# EAGLE design meter (EAGLE 6.5.0)
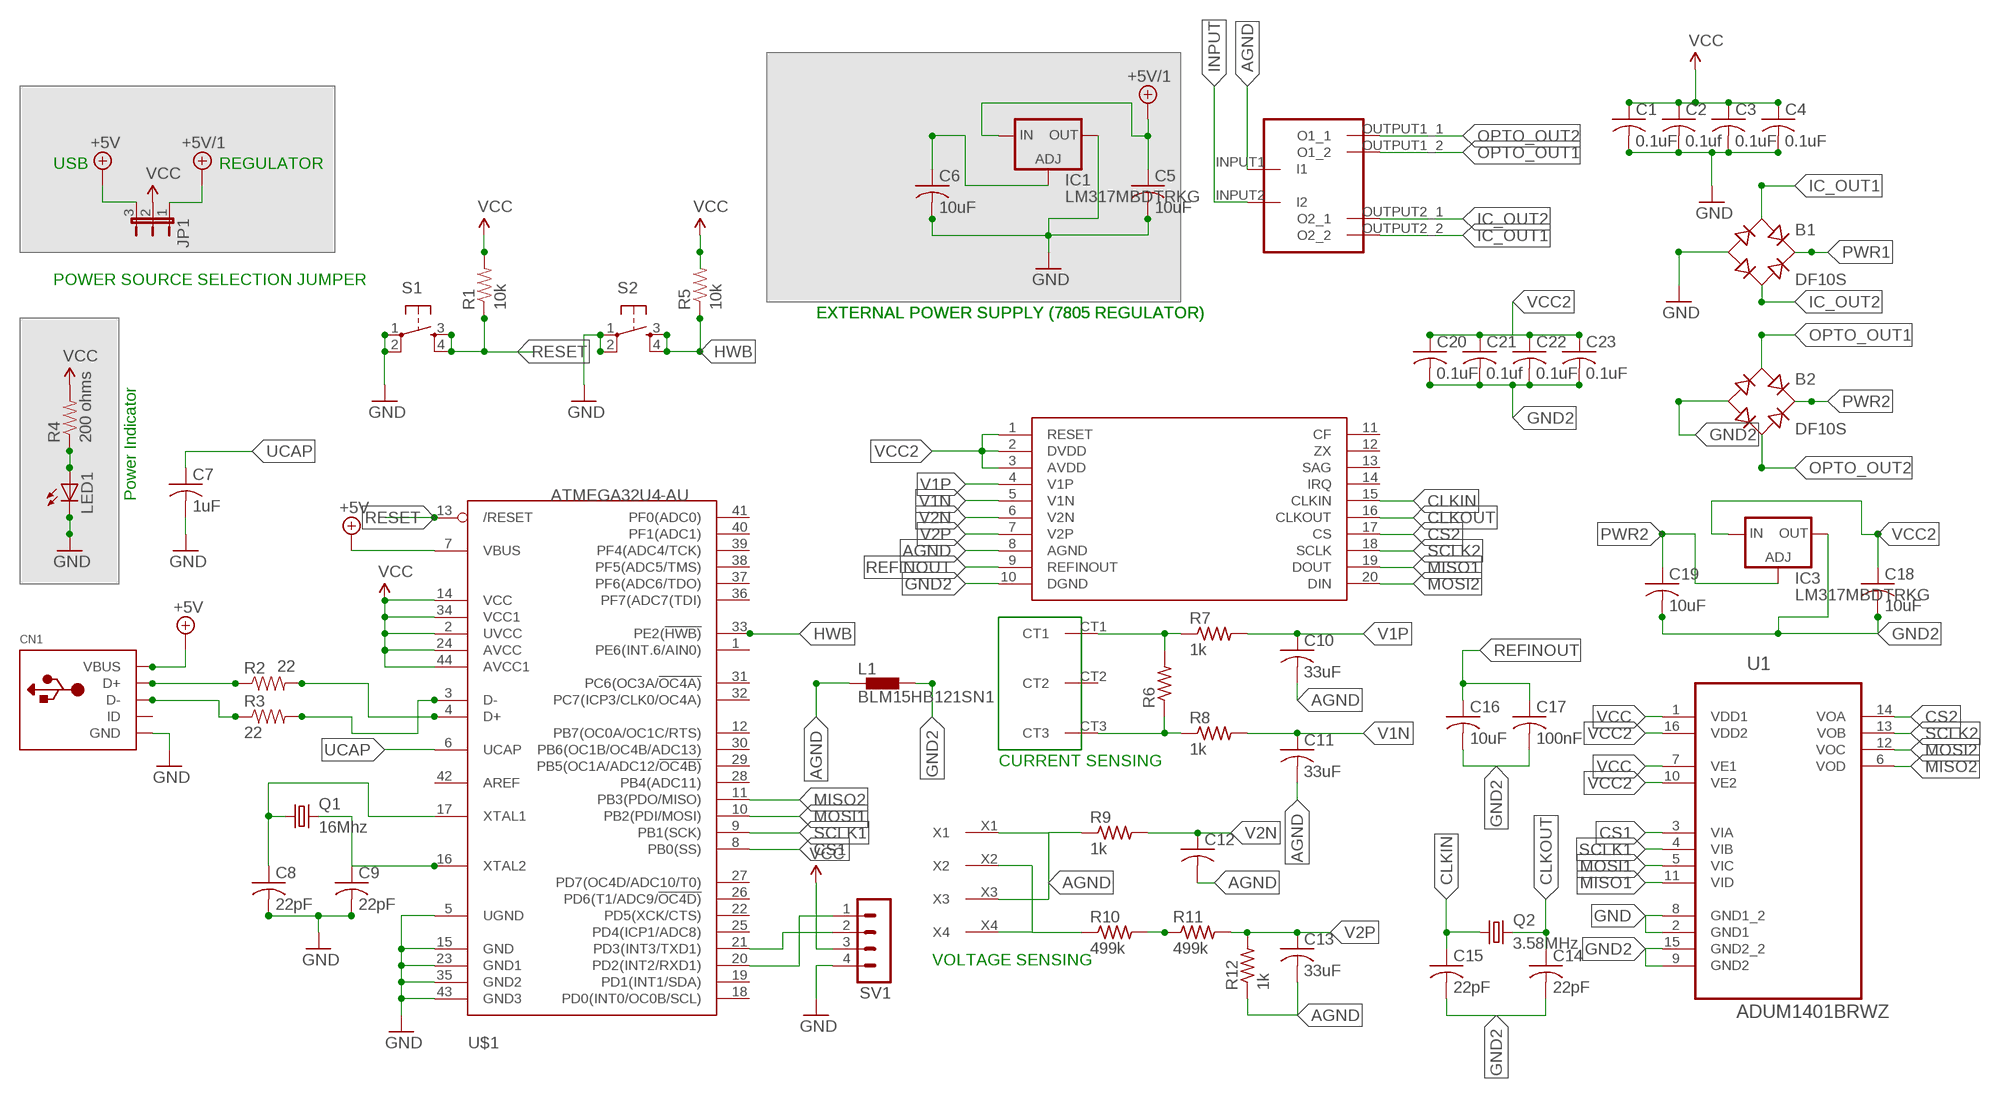
[diagram p0: schematic, sheet 1]

## Parts
B1  DF10S  [DFS]
B2  DF10S  [DFS]
C1  0.1uF  C-USC0603  [C0603]
C2  0.1uf  C-USC0603  [C0603]
C3  0.1uF  C-USC0603  [C0603]
C4  0.1uF  C-USC0603  [C0603]
C5  10uF  C-USC0603  [C0603]
C6  10uF  C-USC0603  [C0603]
C7  1uF  C-USC0603  [C0603]
C8  22pF  C-USC0603  [C0603]
C9  22pF  C-USC0603  [C0603]
C10  33uF  C-USC0603  [C0603]
C11  33uF  C-USC0603  [C0603]
C12  C-USC0603  [C0603]
C13  33uF  C-USC0603  [C0603]
C14  22pF  C-USC0603  [C0603]
C15  22pF  C-USC0603  [C0603]
C16  10uF  C-USC0603  [C0603]
C17  100nF  C-USC0603  [C0603]
C18  10uF  C-USC0603  [C0603]
C19  10uF  C-USC0603  [C0603]
C20  0.1uF  C-USC0603  [C0603]
C21  0.1uf  C-USC0603  [C0603]
C22  0.1uF  C-USC0603  [C0603]
C23  0.1uF  C-USC0603  [C0603]
CN1  USBMINIB  [USB-MINIB]
IC1  LM317MBDTRKG  [DPACK]
IC3  LM317MBDTRKG  [DPACK]
JP1  JP2E  [JP2]
L1  BLM15HB121SN1  [0402]
LED1  LEDCHIP-LED0805  [CHIP-LED0805]
Q1  16Mhz  CSM-7X-DU  [CSM-7X-DU]
Q2  3.58MHz  CSM-7X-DU  [CSM-7X-DU]
R1  10k  RESISTOR0603-RES  [0603-RES]
R2  22  RESISTOR0603-RES  [0603-RES]
R3  22  RESISTOR0603-RES  [0603-RES]
R4  200 ohms  RESISTOR0603-RES  [0603-RES]
R5  10k  RESISTOR0603-RES  [0603-RES]
R6  R-US_R0603  [R0603]
R7  1k  R-US_R0603  [R0603]
R8  1k  R-US_R0603  [R0603]
R9  1k  R-US_R0603  [R0603]
R10  499k  R-US_R0603  [R0603]
R11  499k  R-US_R0603  [R0603]
R12  1k  R-US_R0603  [R0603]
S1  TAC_SWITCHSMD  [TACTILE_SWITCH_SMD]
S2  TAC_SWITCHSMD  [TACTILE_SWITCH_SMD]
SV1  MA04-1  [MA04-1]
U1  ADUM1401BRWZ  [SOIC127P1032X265-16N]
U$1  ATMEGA32U4-AU  [TQFP44]
U$2  ADE7753  [SSOP20]
U$3  CT  [CT1075]
U$4  PCB-TRANS  [PCB-TRANS]
U$6  SCREWTERMINAL4_9.53  [SCREWTERMINAL4_9.53]

## Nets
+5V: CN1.VBUS JP1.3 U$1.7(VBUS)
+5V/1: C5.1 IC1.3(IN) JP1.1
AGND: C10.2 C11.2 C12.2 C13.2 L1.1 R9.1 R12.1 U$2.8(AGND) U$4.INPUT1(I1) U$6.X1 U$6.X3
CLKIN: C15.1 Q2.1 U$2.15(CLKIN)
CLKOUT: C14.1 Q2.2 U$2.16(CLKOUT)
CS1: U1.3(VIA) U$1.8(PB0(SS))
CS2: U1.14(VOA) U$2.17(CS)
GND: B1.- C1.2 C2.2 C3.2 C4.2 C5.2 C6.2 C7.2 C8.2 C9.2 CN1.GND IC1.4(OUT) LED1.C S1.1 S1.2 S2.1 S2.2 SV1.4 U1.2(GND1) U1.8(GND1_2) U$1.5(UGND) U$1.15(GND) U$1.23(GND1) U$1.35(GND2) U$1.43(GND3)
GND2: B2.- C14.2 C15.2 C16.2 C17.2 C18.2 C19.2 C20.2 C21.2 C22.2 C23.2 IC3.4(OUT) L1.2 U1.9(GND2) U1.15(GND2_2) U$2.10(DGND)
HWB: R5.1 S2.3 S2.4 U$1.33(PE2(!HWB))
IC_OUT1: B1.AC1 U$4.OUTPUT2_2(O2_2)
IC_OUT2: B1.AC2 U$4.OUTPUT2_1(O2_1)
INPUT: R10.1 U$4.INPUT2(I2) U$6.X2 U$6.X4
MISO1: U1.11(VID) U$2.19(DOUT)
MISO2: U1.6(VOD) U$1.11(PB3(PDO/MISO))
MOSI1: U1.5(VIC) U$1.10(PB2(PDI/MOSI))
MOSI2: U1.12(VOC) U$2.20(DIN)
N$1: C8.1 Q1.1 U$1.17(XTAL1)
N$2: R10.2 R11.1
N$3: CN1.D+ R2.1
N$4: R2.2 U$1.4(D+)
N$5: CN1.D- R3.1
N$6: R3.2 U$1.3(D-)
N$7: LED1.A R4.1
N$10: SV1.1 U$1.20(PD2(INT2/RXD1))
N$11: SV1.2 U$1.21(PD3(INT3/TXD1))
N$13: R6.2 R7.1 U$3.CT1
N$14: R6.1 R8.1 U$3.CT3
N$17: C9.1 Q1.2 U$1.16(XTAL2)
OPTO_OUT1: B2.AC1 U$4.OUTPUT1_2(O1_2)
OPTO_OUT2: B2.AC2 U$4.OUTPUT1_1(O1_1)
PWR1: B1.+ C6.1 IC1.1(ADJ)
PWR2: B2.+ C19.1 IC3.1(ADJ)
REFINOUT: C16.1 C17.1 U$2.9(REFINOUT)
RESET: R1.1 S1.3 S1.4 U$1.13(/RESET)
SCLK1: U1.4(VIB) U$1.9(PB1(SCK))
SCLK2: U1.13(VOB) U$2.18(SCLK)
UCAP: C7.1 U$1.6(UCAP)
V1N: C11.1 R8.2 U$2.5(V1N)
V1P: C10.1 R7.2 U$2.4(V1P)
V2N: C12.1 R9.2 U$2.6(V2N)
V2P: C13.1 R11.2 R12.2 U$2.7(V2P)
VCC: C1.1 C2.1 C3.1 C4.1 JP1.2 R1.2 R4.2 R5.2 SV1.3 U1.1(VDD1) U1.7(VE1) U$1.2(UVCC) U$1.14(VCC) U$1.24(AVCC) U$1.34(VCC1) U$1.44(AVCC1)
VCC2: C18.1 C20.1 C21.1 C22.1 C23.1 IC3.3(IN) U1.10(VE2) U1.16(VDD2) U$2.1(RESET) U$2.2(DVDD) U$2.3(AVDD)
Unconnected: CN1.ID U$1.1(PE6(INT.6/AIN0)) U$1.12(PB7(OC0A/OC1C/RTS)) U$1.18(PD0(INT0/OC0B/SCL)) U$1.19(PD1(INT1/SDA)) U$1.22(PD5(XCK/CTS)) U$1.25(PD4(ICP1/ADC8)) U$1.26(PD6(T1/ADC9/!OC4D)) U$1.27(PD7(OC4D/ADC10/T0)) U$1.28(PB4(ADC11)) U$1.29(PB5(OC1A/ADC12/!OC4B)) U$1.30(PB6(OC1B/OC4B/ADC13)) U$1.31(PC6(OC3A/!OC4A)) U$1.32(PC7(ICP3/CLK0/OC4A)) U$1.36(PF7(ADC7(TDI)) U$1.37(PF6(ADC6/TDO)) U$1.38(PF5(ADC5/TMS)) U$1.39(PF4(ADC4/TCK)) U$1.40(PF1(ADC1)) U$1.41(PF0(ADC0)) U$1.42(AREF) U$2.11(CF) U$2.12(ZX) U$2.13(SAG) U$2.14(IRQ) U$3.CT2

## Notes on the sheet
- USB | REGULATOR
- POWER SOURCE SELECTION JUMPER
- EXTERNAL POWER SUPPLY (7805 REGULATOR) | EXTERNAL POWER SUPPLY (7805 REGULATOR)
- Power Indicator
- CURRENT SENSING
- VOLTAGE SENSING

## Library data of the parts
B1 B2 = rectifier:DF*S: Surface Mount Glass Passivated Bridge Rectifiers Source: Source: Comchip Bridge Rectifiers DF005S-G thru DF10S-G.pdf
C1-C23 = adafruit:C-US: CAPACITOR, American symbol
CN1 = adafruit:USB: USB Connectors USBMINIB - Surface Mount Female Mini-B USB Connector 4UConnector: 06564 By microbuilder.eu Thru-hole RA Female Mini-B USB Connector 4UConnector: 18732 By ladyada.net
IC1 IC3 = v-reg:LM317?*: 500 mA Adjustable Output Positive Voltage Regulator Source: http://www.onsemi.co.jp .. LM317M-D.PDF
JP1 = jumper:JP2E: JUMPER
L1 = inductors:BLM15H: EMIFIL (R) Chip Ferrite Bead for GHz Noise Source: http://www.murata.com/ Ferrite Bead BLM15H.pdf
LED1 = adafruit:LED: LED OSRAM: - CHIPLED LG R971, LG N971, LY N971, LG Q971, LY Q971, LO R971, LY R971 LH N974, LH R974 LS Q976, LO Q976, LY Q976 LO Q996 - Hyper CHIPLED LW Q18S LB Q993, LB Q99A, LB R99A - SideLED LS A670, LO A670, LY A670, LG A670, LP A670 LB A673, LV A673, LT A673, LW A673 LH A674 LY A675 LS A676, LA A676, LO A676, LY A676, LW A676 LS A679, LY A679, LG A679 - Hyper Micro SIDELED® LS Y876, LA Y876, LO Y876, LY Y876 LT Y87S - SmartLED LW L88C, LW L88S LB L89C, LB L89S, LG L890 LS L89K, LO L89K, LY L89K LS L896, LA L896, LO L896, LY L896 - TOPLED LS T670, LO T670, LY T670, LG T670, LP T670 LSG T670, LSP T670, LSY T670, LOP T670, LYG T670 LG T671, LOG T671, LSG T671 LB T673, LV T673, LT T673, LW T673 LH T674 LS T676, LA T676, LO T676, LY T676, LB T676, LH T676, LSB T676, LW T676 LB T67C, LV T67C, LT T67C, LS T67K, LO T67K, LY T67K, LW E67C LS E67B, LA E67B, LO E67B, LY E67B, LB E67C, LV E67C, LT E67C LW T67C LS T679, LY T679, LG T679 LS T770, LO T770, LY T770, LG T770, LP T770 LB T773, LV T773, LT T773, LW T773 LH T774 LS E675, LA E675, LY E675, LS T675 LS T776, LA T776, LO T776, LY T776, LB T776 LHGB T686 LT T68C, LB T68C - Hyper Mini TOPLED® LB M676 - Mini TOPLED Santana® LG M470 LS M47K, LO M47K, LY M47K Source: http://www.osram.convergy.de/
Q1 Q2 = crystal:CSM-7X-DU: SMD CRYSTAL Source: www.ecsxtal.com .. Crystal 3.6864MHz CSM_7X_DU.PDF; OC_FARNELL: unknown; OC_NEWARK: unknown
R1-R5 = SparkFun-Passives:RESISTOR: Resistor Basic schematic elements and footprints for 0603, 1206, and PTH resistors.
R6-R12 = adafruit:R-US_: RESISTOR, American symbol
S1 S2 = SparkFun-Electromechanical:TAC_SWITCH: Momentary Switch Button commonly used for reset or general input. Spark Fun Electronics SKU : COM-00097 SMT- SWCH-08247; PROD_ID: SWCH-08247
SV1 = con-lstb:MA04-1: PIN HEADER; OC_FARNELL: unknown; OC_NEWARK: unknown
U1 = adum:ADUM1401BRWZ: Quad-Channel Digital Isolators; MPN: ADUM1401BRWZ; OC_FARNELL: 1226221; OC_NEWARK: 59K3278; PACKAGE: SOIC-16; SUPPLIER: Analog Devices
U$1 = adafruit:ATMEGA32U4: http://www.ladyada.net/library/eagle
U$2 = ade7735:ADE7753
U$3 = ct1075:CT
U$4 = pcbtrans:PCB-TRANS
U$6 = screwtermi4:SCREWTERMINAL4_9.53

## Net classes
0 default: clearance 0.381 mm

## Board
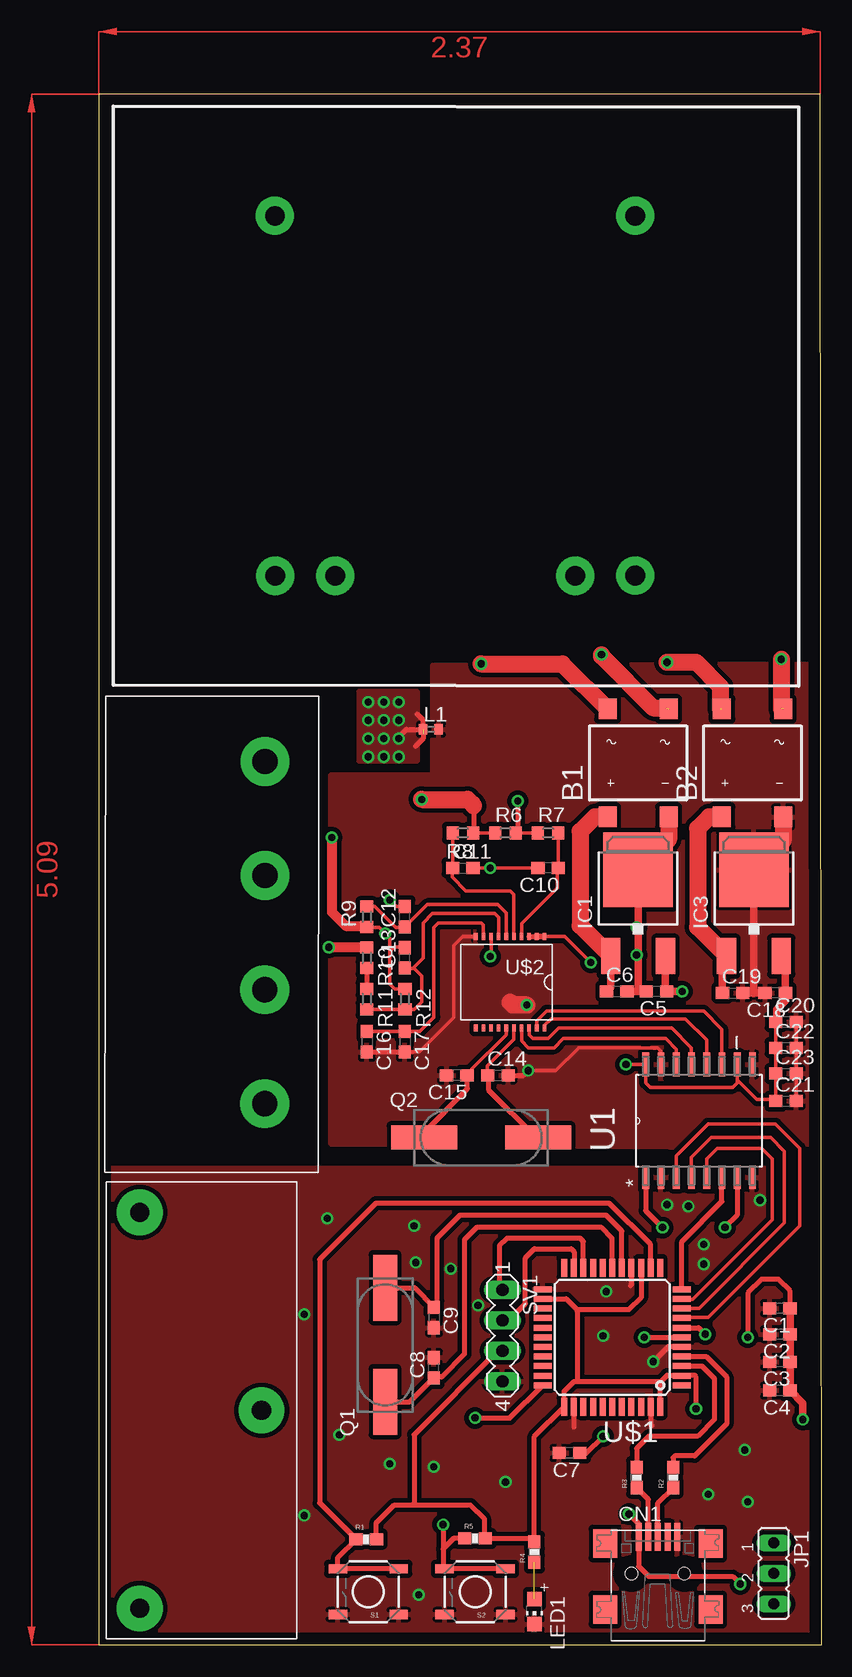
[diagram p1: board, top side]
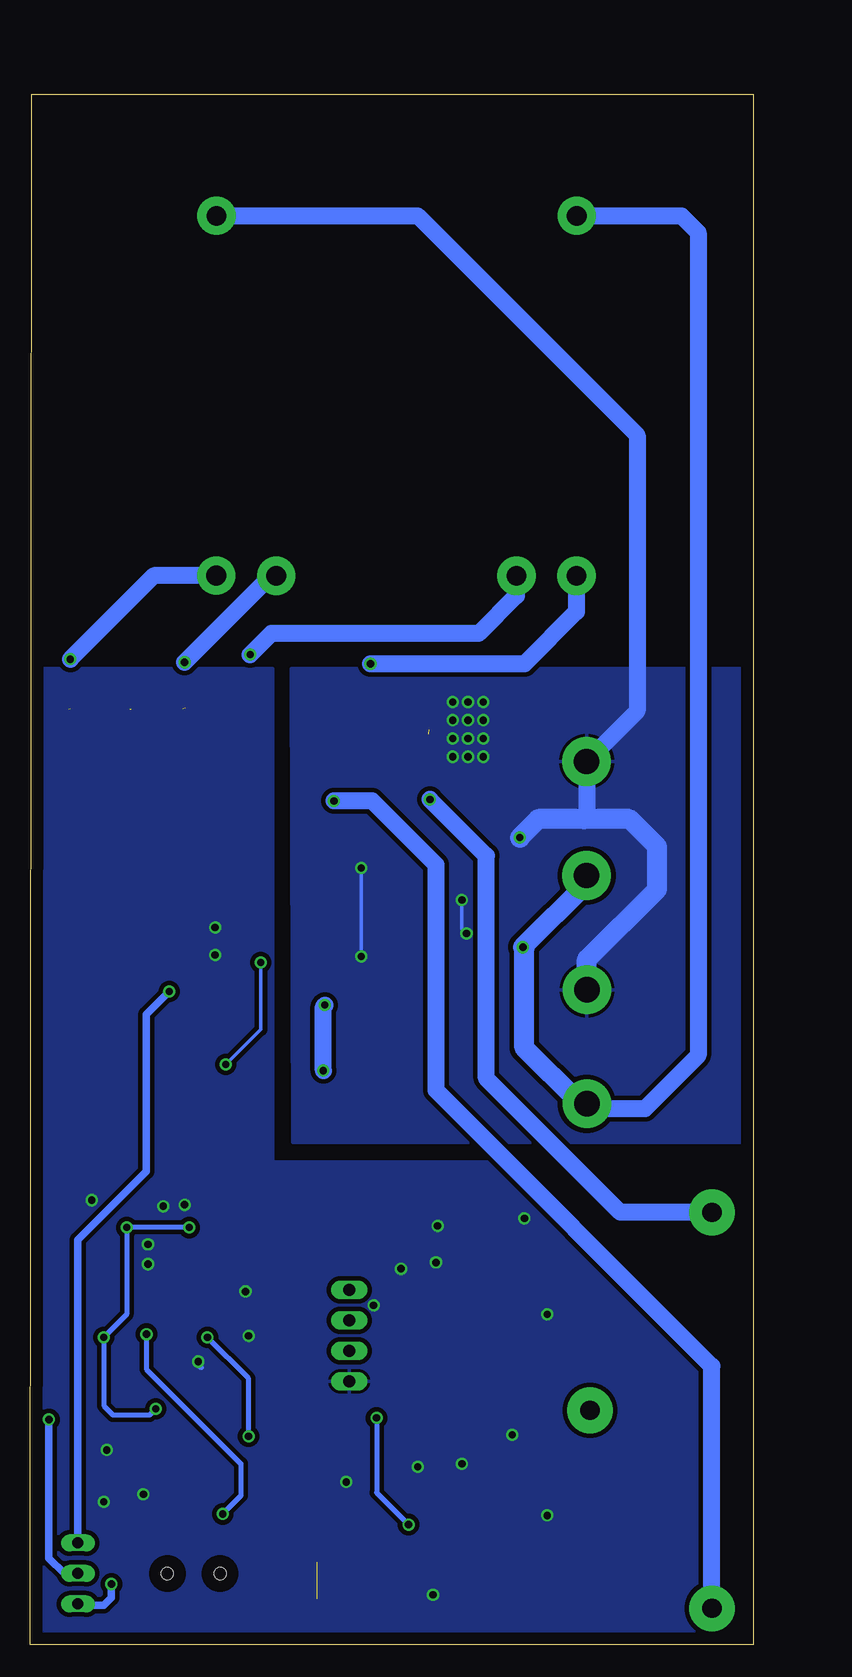
[diagram p2: board, bottom side, seen from below]

Size 60.25 x 129.28 mm. Coordinates in mm from the lower left corner, seen from the top.
Outline: 0,0 60.25,0 60.12,129.28 0,129.28 0,0
Copper layers (1*16): Top 0.035mm / dielectric 1.5mm / Bottom 0.035mm
Design rules "default": minimum track width 10mil, minimum drill 24mil, track to track 8mil, track to pad 8mil, pad to pad 8mil, via to via 8mil, smd to smd 8mil, copper to edge 40mil, drill to drill 8mil, minimum pad ring 10mil, minimum via ring 8mil, stop-mask expansion 4mil, vias tented up to drill 0mil, thermal gap 10mil

### Footprints (pad centres in the part's own frame; a part is rotated, then mirrored left to right if it is on the bottom)
DFS = smd 1.5 x 1.7: + -2.55,-4.5; - 2.55,-4.5; AC1 -2.55,4.5; AC2 2.55,4.5
C0603 = smd 1.1 x 1: 1 -0.85,0; 2 0.85,0
USB-MINIB = smd 0.5 x 2.308: D+ 0,4.064; D- -0.8,4.064; GND 1.6,4.064; ID 0.8,4.064; VBUS -1.6,4.064 | smd 2 x 2.4: GND1 -4.4,-2; GND2 -4.4,3.5; GND3 4.4,3.5; GND4 4.4,-2 | hole 1: -2.2,1; 2.2,1
DPACK = smd 1.6 x 3: 1 -2.28,-4.8; 3 2.28,-4.8 | smd 5.8 x 6.2: 4 0,2.38
JP2 = drill 0.914 long: 1 -2.54,0; 2 0,0; 3 2.54,0
0402 = smd 0.7 x 0.9: 1 -0.65,0; 2 0.65,0
CHIP-LED0805 = smd 1.2 x 1.2: A 0,-1.05; C 0,1.05
CSM-7X-DU = smd 5.5 x 2: 1 -4.75,0; 2 4.75,0
0603-RES = smd 1.1 x 1: 1 -0.85,0; 2 0.85,0
R0603 = smd 1 x 1.1: 1 -0.85,0; 2 0.85,0
TACTILE_SWITCH_SMD = smd 1.524 x 0.762: 1 -2.54,1.905; 2 2.54,1.905; 3 -2.54,-1.905; 4 2.54,-1.905
MA04-1 = drill 1.016 long: 1 -3.81,0; 2 -1.27,0; 3 1.27,0; 4 3.81,0
SOIC127P1032X265-16N = smd 1.981 x 0.559: 1 -4.699,4.445; 2 -4.699,3.175; 3 -4.699,1.905; 4 -4.699,0.635; 5 -4.699,-0.635; 6 -4.699,-1.905; 7 -4.699,-3.175; 8 -4.699,-4.445; 9 4.699,-4.445; 10 4.699,-3.175; 11 4.699,-1.905; 12 4.699,-0.635; 13 4.699,0.635; 14 4.699,1.905; 15 4.699,3.175; 16 4.699,4.445
TQFP44 = smd 1.5 x 0.5: 1 -5.8,4; 2 -5.8,3.2; 3 -5.8,2.4; 4 -5.8,1.6; 5 -5.8,0.8; 6 -5.8,0; 7 -5.8,-0.8; 8 -5.8,-1.6; 9 -5.8,-2.4; 10 -5.8,-3.2; 11 -5.8,-4; 23 5.8,-4; 24 5.8,-3.2; 25 5.8,-2.4; 26 5.8,-1.6; 27 5.8,-0.8; 28 5.8,0; 29 5.8,0.8; 30 5.8,1.6; 31 5.8,2.4; 32 5.8,3.2; 33 5.8,4 | smd 0.5 x 1.5: 12 -4,-5.8; 13 -3.2,-5.8; 14 -2.4,-5.8; 15 -1.6,-5.8; 16 -0.8,-5.8; 17 0,-5.8; 18 0.8,-5.8; 19 1.6,-5.8; 20 2.4,-5.8; 21 3.2,-5.8; 22 4,-5.8; 34 4,5.8; 35 3.2,5.8; 36 2.4,5.8; 37 1.6,5.8; 38 0.8,5.8; 39 0,5.8; 40 -0.8,5.8; 41 -1.6,5.8; 42 -2.4,5.8; 43 -3.2,5.8; 44 -4,5.8
SSOP20 = smd 0.305 x 0.61: 1 -3.493,-3.81; 2 -2.857,-3.81; 3 -2.223,-3.81; 4 -1.587,-3.81; 5 -0.953,-3.81; 6 -0.318,-3.81; 7 0.318,-3.81; 8 0.953,-3.81; 9 1.587,-3.81; 10 2.223,-3.81; 11 2.223,3.81; 12 1.587,3.81; 13 0.953,3.81; 14 0.318,3.81; 15 -0.318,3.81; 16 -0.953,3.81; 17 -1.587,3.81; 18 -2.223,3.81; 19 -2.857,3.81; 20 -3.493,3.81
CT1075 = drill 1.6 pad 3.81: CT1 -16.51,9.915; CT2 0,-0.245; CT3 16.51,9.915
PCB-TRANS = drill 1.651 pad 3.175: INPUT1 14.991,14.988; INPUT2 -15.027,14.988; OUTPUT1_1 15.006,-15.003; OUTPUT1_2 10.001,-15.017; OUTPUT2_1 -10.005,-15.016; OUTPUT2_2 -15.005,-15.017
SCREWTERMINAL4_9.53 = drill 2.108 pad 4.064: X1 -14.342,4.472; X2 -4.831,4.472; X3 4.695,4.442; X4 14.191,4.442

### Placement (x,y rotation side)
B1  44.96,73.53 0 top
B2  54.48,73.53 0 top
C1  56.77,28.07 180 top
C2  56.77,25.91 180 top
C3  56.77,23.62 180 top
C4  56.77,21.21 180 top
C5  46.48,54.48 180 top
C6  43.18,54.48 0 top
C7  39.24,16 180 top
C8  27.94,23.11 90 top
C9  27.94,27.3 270 top
C10  37.47,64.77 180 top
C11  30.35,64.77 0 top
C12  25.53,60.71 90 top
C13  25.53,57.28 90 top
C14  33.27,47.5 0 top
C15  29.84,47.5 180 top
C16  22.35,50.29 270 top
C17  25.53,50.29 270 top
C18  56.39,54.36 180 top
C19  52.83,54.36 0 top
C20  57.28,51.94 0 top
C21  57.28,45.34 0 top
C22  57.28,49.78 0 top
C23  57.28,47.62 0 top
CN1  46.61,4.95 0 top
IC1  44.96,62.23 0 top
IC3  54.61,62.23 0 top
JP1  56.26,5.97 270 top
L1  27.69,76.33 0 top
LED1  36.32,2.79 180 top
Q1  23.88,25.02 90 top
Q2  31.88,42.29 0 top
R1  22.3,8.81 0 top
R2  47.88,13.97 90 top
R3  44.83,13.97 90 top
R4  36.32,7.75 90 top
R5  31.37,8.89 0 top
R6  33.91,67.69 0 top
R7  37.47,67.69 0 top
R8  30.35,67.69 180 top
R9  22.35,60.71 90 top
R10  22.35,57.28 270 top
R11  22.35,53.85 270 top
R12  25.53,53.85 270 top
S1  22.48,4.45 180 top
S2  31.37,4.45 180 top
SV1  33.66,25.78 270 top
U1  50.04,43.69 90 top
U$1  42.8,25.65 180 top
U$2  33.66,55.24 180 top
U$3  13.34,19.56 90 top
U$4  29.72,104.14 0 top
U$6  9.4,59.31 270 top

### Tracks (layer width: path | path; a pad name or v marks a point on that pad's centre or on a via)
+5V  (via drill 0.6)
  Top 0.406: v53.47,5.08 52.83,5.71 45.85,5.71 45.01,6.55 CN1.VBUS 44.96,9.07 44.96,10.16 v44.2,10.92 | U$1.7 50,26.45 v50.55,25.91
  Bottom 0.406: v50.55,25.91 50.55,22.99 42.67,15.11 42.67,12.45 v44.2,10.92
  Bottom 0.61: v53.47,5.08 53.47,3.94 54.1,3.3 56.13,3.3 JP1.3
+5V/1  (via drill 0.6)
  Top 0.61: IC1.3 47.24,54.58 C5.1 v48.64,54.48
  Bottom 0.61: JP1.1 56.26,33.78 50.55,39.5 50.55,52.58 v48.64,54.48
AGND  (via drill 0.6)  (1 unrouted)
  Top 0.305: C11.2 v32.64,64.77 C10.2 | U$2.8 32.7,57.47 v32.64,57.4 | R12.1 24.68,54.7 24.26,55.12 24.26,57.78 | 24.26,57.78 24.64,58.17 25.49,58.17 C13.2 | 24.26,57.78 24.26,58.93 v23.88,59.31 23.37,59.82 22.39,59.82 R9.1 | C12.2 24.8,61.56 v24.26,62.1
  Top 0.406: v25.02,75.56 25.02,75.69 25.65,76.33 L1.1 | L1.1 27.05,77.09 26.54,77.6 | 27.05,75.95 27.05,75.56 26.42,74.93
  Top 0.813: v19.43,67.31 19.43,61.09 20.57,59.94 22.26,59.94 R9.1
  Bottom 0.305: v32.64,57.4 v32.64,64.77 | v24.26,62.1 24.26,59.69 v23.88,59.31
  Bottom 1.422: U$4.INPUT1 27.94,119.13 9.65,100.84 9.65,77.87 U$6.X1 13.87,69.06 14.1,68.83
  Bottom 1.676: U$6.X3 13.84,57.15 8,62.99 8,66.55 10.29,68.83 14.1,68.83 17.91,68.83 v19.43,67.31
  other vias: 22.48,78.61 23.75,77.09 23.75,78.61 25.02,78.61 22.48,77.09 25.02,77.09 22.48,75.56 23.75,75.56 22.48,74.04 23.75,74.04 25.02,74.04
  pour Bottom: -0.38,81.28 -0.51,41.91 38.35,41.91 38.48,81.41 -0.51,81.41 -0.51,81.03
  pour Top: 26.54,79.5 26.54,73.66 21.72,73.66 21.72,79.5
CLKIN
  Top 0.305: U$2.15 33.97,50.86 31.11,48.01 31.11,47.92 C15.1
  Top 0.406: Q2.1 27.13,42.75 30.73,46.35 30.73,47.46 C15.1
CLKOUT
  Top 0.305: U$2.16 34.61,50.48 32.38,48.26 32.38,47.54 C14.1
  Top 0.406: Q2.2 36.45,42.29 32.51,46.23 32.51,47.41 C14.1
CS1
  Top 0.305: U1.3 48.13,40.77 50.8,43.43 56.39,43.43 58.42,41.4 58.42,34.92 50.8,27.3 48.65,27.3 U$1.8
CS2
  Top 0.305: U$2.17 35.24,50.35 35.81,49.78 37.97,49.78 38.73,50.55 47.24,50.55 48.13,49.66 U1.14
GND  (via drill 0.6)
  Top 0.305: 44.96,54.48 44.96,57.4 v44.83,57.53
  Top 0.406: U$1.15 44.4,30.05 44.32,29.97 | U$1.43 46,18.39 46.1,18.29 | U$1.35 39.6,18.19 39.62,18.16 | U$1.5 47.46,24.85 v46.23,23.62
  Top 0.61: C6.2 44.96,54.48 | 44.96,54.48 C5.2 | IC1.4 44.96,54.48
  Top 1.422: B1.- 47.51,67.16 IC1.4
  Bottom 0.406: v46.23,23.62 46.23,23.37 45.97,23.11
  other vias: 47.37,36.7 19.05,35.56 50.8,12.57 54.1,11.94 53.85,16.26 33.91,13.59 24.26,15.11 27.94,14.86 17.14,10.79 50.42,33.4 31.62,28.32 42.04,25.78 55.12,37.08 50.42,31.75 49.15,36.58 26.29,34.92 26.42,31.88 29.34,31.37 17.14,27.56 20.07,17.53 26.67,4.19 42.29,29.46 44.83,59.82
  pour Bottom: 40.01,81.28 40.01,40.26 -0.51,40.26 -0.51,-0.51 59.82,-0.51 59.82,81.41 40.01,81.41
  pour Top: -0.89,39.75 60.83,39.75 60.83,-0.38 -0.89,-0.38
GND2  (via drill 0.6)
  Top 0.305: C21.2 C23.2 C22.2 C20.2 | C17.2 26.71,49.44 29.59,52.32 29.59,58.29 30.35,59.05 U$2.10 | U1.15 46.86,49.53 46.61,49.78 40.01,49.78 38.1,47.88 v35.81,47.88
  Top 0.406: C16.2 C17.2 | C14.2 35.43,47.5 v35.81,47.88
  Top 0.61: C19.2 54.23,54.36 | 54.23,54.36 C18.2 | IC3.4 54.61,54.74 54.23,54.36
  Top 1.422: v35.69,53.34 34.54,53.34 34.29,53.59 | B2.- 57.03,67.03 IC3.4
  Bottom 1.422: v35.81,47.88 35.81,53.21 v35.69,53.34
  pour Top: 19.3,72.52 19.3,41.78 61.59,41.4 61.59,81.79 27.81,81.66 27.81,72.52
HWB  (via drill 0.6)
  Top 0.406: R5.1 29.59,8.89 28.7,8 | 28.7,8 28.7,6.48 S2.4 S2.3 | v28.7,10.03 28.7,8 | v31.37,18.92 34.27,18.92 U$1.33
  Bottom 0.406: v31.37,18.92 31.37,12.7 v28.7,10.03
IC_OUT1  (via drill 0.6)
  Top 1.422: v31.88,81.79 38.65,81.79 B1.AC1
  Bottom 1.422: U$4.OUTPUT2_2 14.71,86.12 19.05,81.79 v31.88,81.79
IC_OUT2  (via drill 0.6)  (1 unrouted)
  Top 1.422: v41.91,82.55 41.91,82.42 46.23,78.11 47.31,78.11
  Bottom 1.422: U$4.OUTPUT2_1 19.71,87.47 22.86,84.33 40.13,84.33 v41.91,82.55
INPUT  (via drill 0.6)
  Top 0.813: v19.18,58.17 22.31,58.17 R10.1
  Bottom 1.422: U$4.INPUT2 5.97,119.13 4.57,117.73 4.57,49.15 9.02,44.7 13.97,44.7 14.54,45.28
  Bottom 1.676: U$6.X2 13.87,63.47 v19.18,58.17 19.05,58.04 19.05,49.78 14.54,45.28 14.38,45.12 U$6.X4
MISO1
  Top 0.305: U$2.19 36.51,52.01 37.34,52.83 50.42,52.83 51.94,51.31 U1.11
MISO2
  Top 0.406: U$1.11 48.6,33.61 51.94,36.96 U1.6
MOSI1
  Top 0.305: U1.5 50.67,40.51 51.56,41.4 55.24,41.4 56.13,40.51 56.13,35.43 49.53,28.83 48.62,28.83 U$1.10
MOSI2
  Top 0.305: U$2.20 37.15,51.63 37.72,52.2 48.9,52.2 50.67,50.42 U1.12
N$1
  Top 0.406: Q1.1 25.95,20.27 C8.1 28.03,22.35 28.57,22.35 30.48,24.26 30.48,33.78 31.5,34.8 41.91,34.8 42.8,33.91 U$1.17
N$2
  Top 0.406: R10.2 R11.1
N$3
  Top 0.406: CN1.D+ 46.61,11.85 R2.1
N$4
  Top 0.406: U$1.4 50.62,24.05 52.32,22.35 52.32,18.41 49.66,15.75 48.01,15.75 47.88,15.62 R2.2
N$5
  Top 0.406: CN1.D- 45.81,12.14 R3.1
N$6
  Top 0.406: U$1.3 50.28,23.25 51.31,22.23 51.31,18.8 49.91,17.4 45.85,17.4 44.83,16.38 R3.2
N$7  (1 unrouted)
N$10
  Top 0.406: U$1.20 40.4,33.64 40.13,33.91 34.04,33.91 33.4,33.27 33.4,29.84 SV1.1
N$11
  Top 0.406: SV1.2 34.16,27.05 35.56,28.45 35.56,32.26 36.32,33.02 39.37,33.02 39.62,32.77 39.62,31.48 U$1.21
N$13  (via drill 0.6)
  Top 0.305: R6.2 R7.1
  Top 0.406: v34.92,70.36 34.92,67.86 R6.2
  Bottom 1.422: U$3.CT1 3.42,23.23 26.42,46.23 26.42,65.02 31.75,70.36 v34.92,70.36
N$14  (via drill 0.6)
  Top 0.305: R8.1 R6.1
  Top 0.406: 31.24,69.98 31.24,67.73 R8.1
  Top 1.422: v26.92,70.48 30.73,70.48 31.24,69.98
  Bottom 1.422: U$3.CT3 11.05,36.07 22.23,47.24 22.23,65.79 v26.92,70.48
N$17
  Top 0.406: Q1.2 26.33,29.77 C9.1 28.19,28.41 28.19,33.91 30.1,35.81 42.29,35.81 43.6,34.51 U$1.16
OPTO_OUT1  (via drill 0.6)  (1 unrouted)
  Top 1.422: v47.37,81.92 49.78,81.92 51.82,79.88 51.82,78.02
  Bottom 1.422: U$4.OUTPUT1_2 40.16,89.12 v47.37,81.92
OPTO_OUT2  (via drill 0.6)  (1 unrouted)
  Top 1.422: v56.9,82.17 56.9,78.04
  Bottom 1.422: U$4.OUTPUT1_1 49.93,89.14 v56.9,82.17
PWR1
  Top 0.61: IC1.1 42.68,54.83 C6.1
  Top 1.422: B1.+ 41.35,69.03 40.13,67.82 40.13,59.98 IC1.1
PWR2
  Top 0.61: C19.1 51.98,57.08 IC3.1
  Top 1.422: B2.+ 50.87,69.03 49.91,68.07 49.91,59.85 IC3.1
REFINOUT
  Top 0.305: C16.1 C17.1 26.76,51.14 27.94,52.32 27.94,59.82 28.32,60.2 31.88,60.2 32.07,60.01 U$2.9
RESET
  Top 0.406: U$1.13 46,33.38 42.55,36.83 23.11,36.83 18.41,32.13 18.41,11.85 R1.1 | 21.34,8.93 R1.1 | R1.1 19.94,7.3 S1.4 S1.3
SCLK1
  Top 0.305: U1.4 49.4,40.64 51.05,42.29 56.01,42.29 57.15,41.15 57.15,35.18 50.04,28.07 48.61,28.07 U$1.9
SCLK2
  Top 0.305: U$2.18 35.88,50.86 36.2,50.55 37.47,50.55 38.35,51.44 47.75,51.44 49.4,49.78 U1.13
UCAP  (via drill 0.6)
  Top 0.406: C7.1 40.64,16 v42.04,17.4 | v45.47,25.65 U$1.6
  Bottom 0.406: v42.04,17.4 42.04,22.23 v45.47,25.65
V1N
  Top 0.305: R8.2 C11.1 29.46,64.73 29.46,64.01 30.61,62.87 34.29,62.87 34.61,62.55 U$2.5
V1P
  Top 0.305: U$2.4 35.24,60.13 38.23,63.12 38.23,64.68 C10.1 R7.2
V2N
  Top 0.305: R9.2 23.03,61.56 24.77,59.82 25.49,59.82 C12.1 27.39,61.72 33.27,61.72 33.97,61.02 U$2.6
V2P
  Top 0.305: U$2.7 33.34,60.64 33.02,60.96 27.81,60.96 27.05,60.2 27.05,57.28 26.16,56.39 | 26.16,56.39 25.57,56.39 C13.1 | 26.16,56.39 26.29,56.39 26.92,55.75 26.92,53.59 26.29,52.96 25.57,52.96 R12.2 R11.2
VCC  (via drill 0.6)
  Top 0.406: C3.1 57.62,29.5 56.64,30.48 55.24,30.48 54.1,29.34 v54.1,25.65 | v49.78,19.68 49.78,22.35 49.66,22.48 48.62,22.48 U$1.2 48.57,22.48 47.37,22.48 46.8,21.91 | U$1.44 46.8,21.91 | 40.01,21.97 39.62,21.97 38.8,21.15 U$1.34 36.32,17.38 R4.2 36.03,8.89 R5.2 32.13,8.98 32.13,10.54 30.99,11.68 26.16,11.68 | 40.01,21.97 46.73,21.97 46.8,21.91 | U$1.24 38.96,28.85 39.88,27.94 39.88,27.81 | 39.88,27.81 39.88,22.1 40.01,21.97 | U$1.14 45.2,28.94 44.2,27.94 40.01,27.94 39.88,27.81 | R1.2 23.15,10.2 24.64,11.68 26.16,11.68 | U1.7 53.21,35.81 v52.2,34.8 | U1.1 45.59,36.2 v46.99,34.8 | SV1.3 33.27,24.51 26.29,17.53 26.29,11.81 26.16,11.68
  Top 0.61: v58.67,18.8 58.67,20.15 C4.1 C3.1 C2.1 C1.1
  Bottom 0.406: v49.78,19.68 50.29,19.18 53.34,19.18 54.1,19.94 v54.1,25.65 52.2,27.56 v52.2,34.8 v46.99,34.8
  Bottom 0.61: JP1.2 57.4,5.97 58.67,7.24 v58.67,18.8
VCC2  (via drill 0.6)
  Top 0.305: U$2.1 37.21,59.05 38.86,59.05 v41.02,56.9 | v43.94,48.39 U1.16 45.59,46.86 45.97,46.48 52.83,46.48 53.21,46.86 U1.10 53.21,47.12 54.86,45.47 56.3,45.47 C21.1 C23.1 C22.1 C20.1
  Top 0.406: U$2.2 U$2.1 | U$2.3 U$2.2 | 37.21,59.05 U$2.2
  Top 0.61: IC3.3 57.24,57.08 C18.1 57.24,53.68 56.52,52.96 56.52,52.03 C20.1
  Bottom 0.305: v41.02,56.9 41.02,51.31 v43.94,48.39
(copper drawn outside any net)
  shapes: Top area x2